# Altium schematic sheet Supplies02.SchDoc
size 431 x 279 mm; SheetNumber: 2; SheetTotal: 2; ENG_APP_DATE: --/--/--; DSN_APP_DATE: --/--/--; CHK_APP_DATE: --/--/--
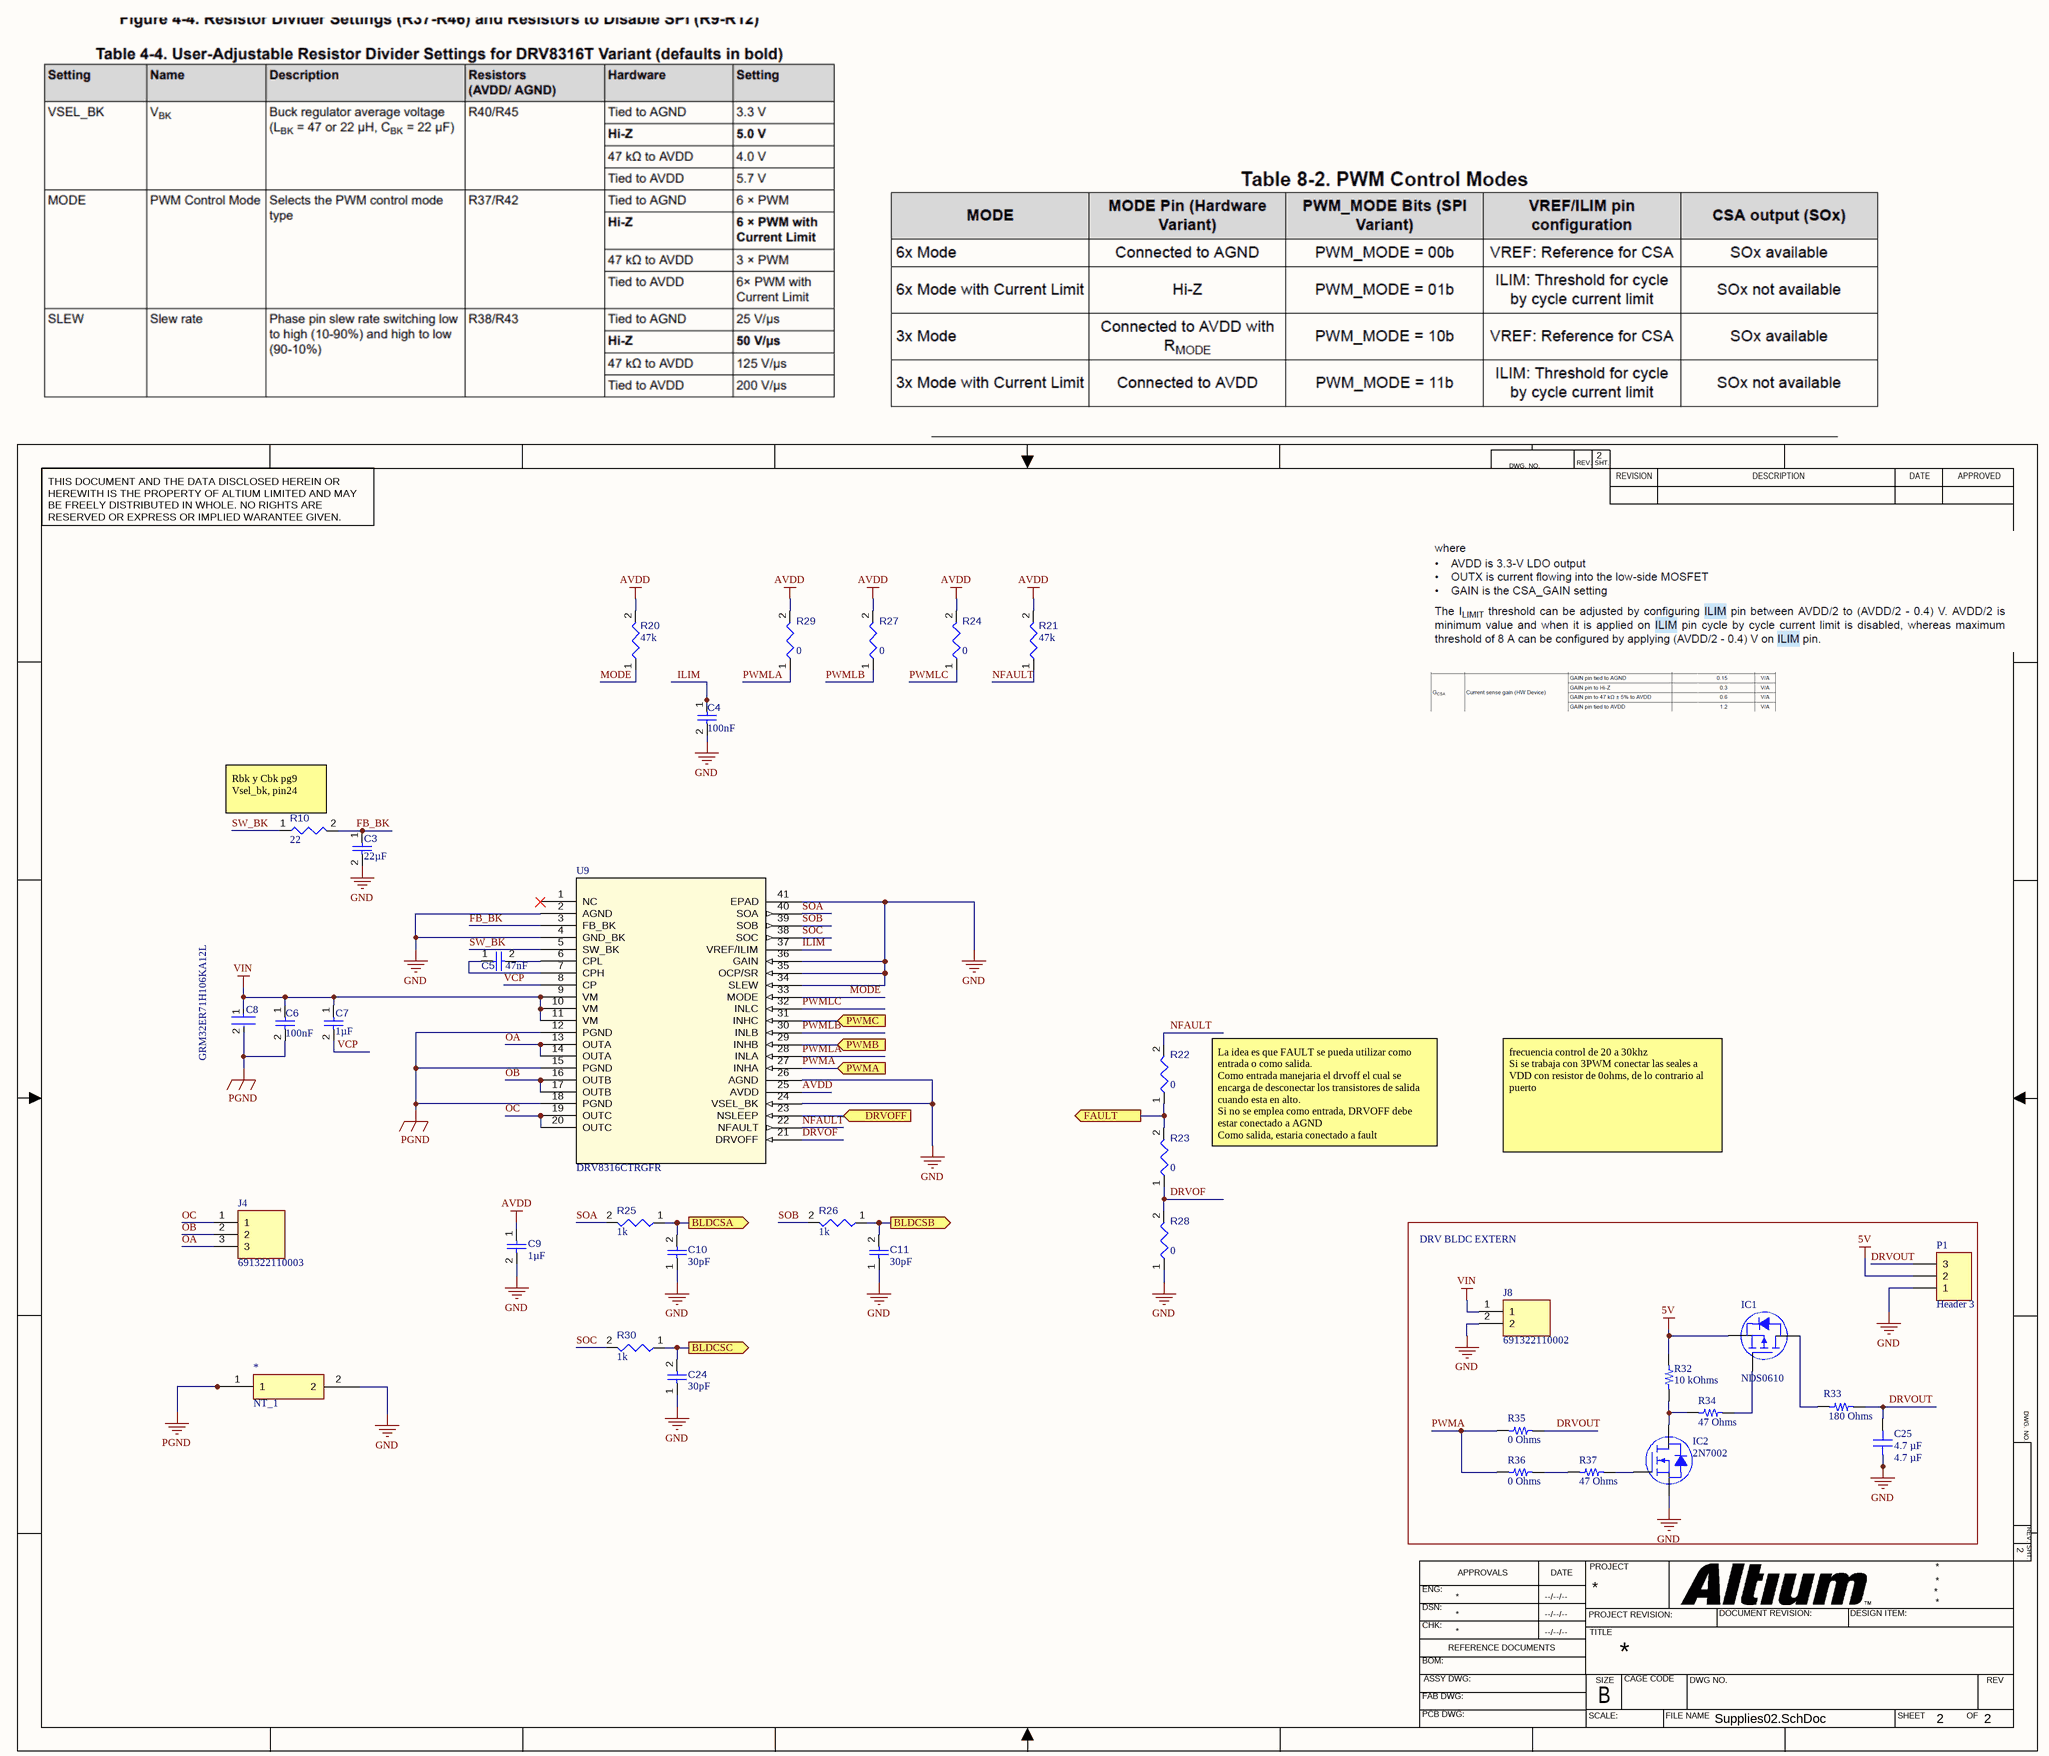
[diagram p0: Supplies02.SchDoc]

## Parts
*  NT_1  [Net_Tie]  (net tie, no BOM)
C3  value 22µF  [CAPC0805(2012)145_L]  (hidden comment: Capacitor 22µF +/-40% 16V 0805)
C4  value 100nF  [CAPC1608X90X40NL10T20]  (hidden comment: Capacitor 100 nF +/-10% 50 V 0603)
C5  value 47nF  [CAPC1608X90X40NL10T20]  (hidden comment: Capacitor 100 nF +/-10% 50 V 0603)
C6  value 100nF  [CAPC1608X90X40NL10T20]  (hidden comment: Capacitor 100 nF +/-10% 50 V 0603)
C7  value 1µF  [CAPC0805(2012)145_L]  (hidden comment: Capacitor 22µF +/-40% 16V 0805)
C8  GRM32ER71H106KA12L  [FP-GRM32-MFG]
C9  value 1µF  [CAPC0805(2012)145_L]  (hidden comment: Capacitor 22µF +/-40% 16V 0805)
C10  value 30pF  [CAPC1608X90X40NL10T20]  (hidden comment: Capacitor 100 nF +/-10% 50 V 0603)
C11  value 30pF  [CAPC1608X90X40NL10T20]  (hidden comment: Capacitor 100 nF +/-10% 50 V 0603)
C24  value 30pF  [CAPC1608X90X40NL10T20]  (hidden comment: Capacitor 100 nF +/-10% 50 V 0603)
C25  4.7 µF  [CAP 0805_2012]
IC1  NDS0610  [ON SEMI SOT-23-3]
IC2  2N7002  [ON SEMI SOT-23-3]
J4  691322110003  [SHDRRA3W80P0X350_1X3_1190X920X700P]
J8  691322110002  [SHDRRA2W80P0X350_1X2_840X920X720P]
P1  Header 3  [HDR1X3]
R10  value 22  [RESC1608X55X25ML10T15]  (hidden comment: Resistor 10k +/-1% 0603 100 mW)
R20  value 47k  [RESC1608X55X25ML10T15]  (hidden comment: Resistor 10k +/-1% 0603 100 mW)
R21  value 47k  [RESC1608X55X25ML10T15]  (hidden comment: Resistor 10k +/-1% 0603 100 mW)
R22  value 0  [RESC1608X55X25ML10T15]  (hidden comment: Resistor 10k +/-1% 0603 100 mW)
R23  value 0  [RESC1608X55X25ML10T15]  (hidden comment: Resistor 10k +/-1% 0603 100 mW)
R24  value 0  [RESC1608X55X25ML10T15]  (hidden comment: Resistor 10k +/-1% 0603 100 mW)
R25  value 1k  [RESC1608X55X25ML10T15]  (hidden comment: Resistor 10k +/-1% 0603 100 mW)
R26  value 1k  [RESC1608X55X25ML10T15]  (hidden comment: Resistor 10k +/-1% 0603 100 mW)
R27  value 0  [RESC1608X55X25ML10T15]  (hidden comment: Resistor 10k +/-1% 0603 100 mW)
R28  value 0  [RESC1608X55X25ML10T15]  (hidden comment: Resistor 10k +/-1% 0603 100 mW)
R29  value 0  [RESC1608X55X25ML10T15]  (hidden comment: Resistor 10k +/-1% 0603 100 mW)
R30  value 1k  [RESC1608X55X25ML10T15]  (hidden comment: Resistor 10k +/-1% 0603 100 mW)
R32  10 kOhms  [YAGEO RES 0603_1608]
R33  180 Ohms  [YAGEO RES 0603_1608]
R34  47 Ohms  [YAGEO RES 0603_1608]
R35  0 Ohms  [YAGEO RES 0603_1608]
R36  0 Ohms  [YAGEO RES 0603_1608]
R37  47 Ohms  [YAGEO RES 0603_1608]
U9  DRV8316CTRGFR  [VQFN40_RGF_TEX]

## Blocks framed on the sheet
DRV BLDC EXTERN: C25 IC1 IC2 J8 P1 R32-R37

## Ports
BLDCSA (out), BLDCSB (out), BLDCSC (out), DRVOFF (in), FAULT (out), PWMA (in), PWMB (in), PWMC (in)

## Nets
5V: IC1.2(S) P1.2 R32.2
AVDD: C9.1 R20.2 R21.2 R24.2 R27.2 R29.2 U9.25(AVDD)
GND: *.2 C3.2 C4.2 C9.2 C10.1 C11.1 C24.1 C25.1 IC2.2(S) J8.2 P1.1 R28.1 U9.2(AGND) U9.4(GND_BK) U9.24(VSEL_BK) U9.26(AGND) U9.34(SLEW) U9.35(OCP/SR) U9.36(GAIN) U9.41(EPAD)
PGND: *.1 C6.2 C8.2 U9.12(PGND) U9.15(PGND) U9.18(PGND)
VIN: C6.1 C7.1 C8.1 J8.1 U9.9(VM) U9.10(VM) U9.11(VM)
BLDCSA: C10.2 R25.1 ; port BLDCSA
BLDCSB: C11.2 R26.1 ; port BLDCSB
BLDCSC: C24.2 R30.1 ; port BLDCSC
DRVOF: R23.1 R28.2 U9.21(DRVOFF)
DRVOFF: U9.23(NSLEEP) ; port DRVOFF
DRVOUT: C25.2 P1.3 R33.2 R35.2
FAULT: R22.1 R23.2 ; port FAULT
FB_BK: C3.1 R10.2 U9.3(FB_BK)
ILIM: C4.1 U9.37(VREF/ILIM)
MODE: R20.1 U9.33(MODE)
NFAULT: R21.1 R22.2 U9.22(NFAULT)
OA: J4.3 U9.13(OUTA) U9.14(OUTA)
OB: J4.2 U9.16(OUTB) U9.17(OUTB)
OC: J4.1 U9.19(OUTC) U9.20(OUTC)
PWMA: R35.1 R36.1 U9.27(INHA) ; port PWMA
PWMB: U9.29(INHB) ; port PWMB
PWMC: U9.31(INHC) ; port PWMC
PWMLA: R29.1 U9.28(INLA)
PWMLB: R27.1 U9.30(INLB)
PWMLC: R24.1 U9.32(INLC)
SOA: R25.2 U9.40(SOA)
SOB: R26.2 U9.39(SOB)
SOC: R30.2 U9.38(SOC)
SW_BK: R10.1 U9.5(SW_BK)
VCP: C7.2 U9.8(CP)
NetC5_1: C5.1 U9.7(CPH)
NetC5_2: C5.2 U9.6(CPL)
NetIC1_1: IC1.1(G) R34.2
NetIC1_3: IC1.3(D) R33.1
NetIC2_1: IC2.1(G) R37.2
NetIC2_3: IC2.3(D) R32.1 R34.1
NetR36_2: R36.2 R37.1

Not connected (* = marked no-connect by the designer): U9 1(NC)*

## Notes on the sheet
- (near R10) Rbk y Cbk pg9
  Vsel_bk, pin24
- La idea es que FAULT se pueda utilizar como entrada o como salida.
  Como entrada manejaria el drvoff el cual se encarga de desconectar los transistores de salida cuando esta en alto.
  Si no se emplea como entrada, DRVOFF debe estar conectado a AGND
  Como salida, estaria conectado a fault
- frecuencia control de 20 a 30khz
  Si se trabaja con 3PWM conectar las seales a VDD con resistor de 0ohms, de lo contrario al puerto
- DWG. NO.
- REV.
- SHT.
- THIS DOCUMENT AND THE DATA DISCLOSED HEREIN OR HEREWITH IS THE PROPERTY OF ALTIUM LIMITED AND MAY BE FREELY DISTRIBUTED IN WHOLE. NO RIGHTS ARE RESERVED OR EXPRESS OR IMPLIED WARANTEE GIVEN.
- REVISION
- DESCRIPTION
- DATE
- APPROVED
- ENG:
- APPROVALS
- PROJECT
- DSN:
- CHK:
- REFERENCE DOCUMENTS
- PROJECT REVISION:
- TITLE
- DOCUMENT REVISION:
- DESIGN ITEM:
- BOM:
- FAB DWG:
- PCB DWG:
- ASSY DWG:
- SCALE:
- SIZE
- B
- CAGE CODE
- FILE NAME
- DWG NO.
- SHEET
- OF
- REV

## Library data of the parts
C3 C7 C9 = CMP-001-00081-4: Chip Capacitor, 22µF +/-40%, 16V, 0805, Thickness 1.45 mm; Tolerance: 5%; Voltage Rating: 16V; Mounting Technology: SMT; Pins: 2; Max Operating Temperature: 85°C; Case/Package: 0805; Min Operating Temperature: -55°C
C4-C6 C10 C11 C24 = CMP-001-00017-6: Chip Capacitor, 100 nF, +/- 10%, 50 V, 0603 (1608 Metric); Capacitor Type: Ceramic; Voltage Rating: 50V; Max Operating Temperature: 125°C; Min Operating Temperature: -55°C; Case/Package: 0603; Mounting Technology: SM; Pins: 2; Tolerance: 10%; RoHS Compliant: True
C8 = CMP-2000-05261-2: CAP CER 10UF 50V X7R 1210; Manufacturer: Murata; Tolerance: 10%; Material: Ceramic; Temperature Coefficient: 15%; Voltage Rating: 50V; Temperature Characteristic: X7R; Value: 10uF; ComponentLink2Description: Datasheet; Device Class L1: Passive Components; Lead Free: Yes; Temperature Range High: +125°C; Category: Cap; Manufacturer Part Number: GRM32ER71H106KA12L; ComponentLink2URL: https://search.murata.co.jp/Ceramy/image/img/A01X/G101/ENG/GRM32ER71H106KA12-01.pdf; Device Class L2: Capacitors; Package: GRM32; Mouser Description: 1210 10 uF 50 V ±10% Tolerance X7R SMT Multilayer Ceramic Capacitor; Capacitance: 10uF; Octopart: https://octopart.com/grm32er71h106ka12l-murata-10470987; Digikey Description: CAP CER 10UF 50V X7R 1210; Height: 2.7mm; Temperature: -55°C to +125°C; Temperature Range Low: -55°C; RoHS: TRUE; Device Class L3: Ceramic Capacitors; Automotive: No
C25 = C0805X475J9RACAUTO: CAP CER 4.7UF 6.3V X7R 0805; manufacturer: KEMET; Tolerance: ±5%; Part Number: C0805X475J9RACAUTO; Capacitance: 4.7 µF; Applications: Automotive, Boardflex Sensitive; componentlink1description: Datasheet; componentlink1url: https://api.kemet.com/component-edge/download/datasheet/C0805X475J9RACAUTO.pdf; componentlink2description: DigiKey Link; componentlink2url: https://www.digikey.com/en/products/detail/kemet/C0805X475J9RACAUTO/7427557; Device Package: 0805 (2012 Metric); Features: Soft Termination; lastupdated: 2024-02-09 20:16:08; Lifecycle Status: Active; Minimum Order: 1; Mounting Type: Surface Mount, MLCC; Operating Temperature: -55°C ~ 125°C; Package / Case: 0805 (2012 Metric); packaging: TapeAndReel; partid: 2889; Part Status: Active; price: 0.20; Ratings: AEC-Q200; series: SMD Auto X7R Flex; Size / Dimension: 0.079" L x 0.049" W (2.00mm x 1.25mm); Supplier 1: DigiKey; Supplier Part Number 1: 399-15727-1-ND; Temperature Coefficient: X7R; Thickness (Max): 0.057" (1.45mm); value: 4.7 µF; Voltage - Rated: 6.3V
IC1 = NDS0610: MOSFET P-CH 60V 120MA SOT-23; Manufacturer: ON Semiconductor; Current - Continuous Drain (Id) @ 25°C: 120mA (Ta); Drive Voltage (Max Rds On,  Min Rds On): 4.5V, 10V; FET Type: P-Channel; Gate Charge (Qg) (Max) @ Vgs: 2.5nC @ 10V; Input Capacitance (Ciss) (Max) @ Vds: 79pF @ 25V; Power Dissipation (Max): 360mW (Ta); Rds On (Max) @ Id, Vgs: 10Ohm @ 500mA, 10V; Vgs (Max): ±20V; Vgs(th) (Max) @ Id: 3.5V @ 1mA; Part Number: NDS0610; ComponentLink1Description: Datasheet; ComponentLink1URL: https://www.onsemi.com/pub/Collateral/NDS0610-D.PDF; ComponentLink2Description: DigiKey Link; ComponentLink2URL: http://digikey.com/product-detail/en/on-semiconductor/NDS0610/NDS0610CT-ND/244299; Drain to Source Voltage (Vdss): 60V; LastUpdated: 2024-06-03 20:15:27; Lifecycle Status: Active; Minimum Order: 1; Mounting Type: Surface Mount; Operating Temperature: -55°C ~ 150°C (TJ); Package / Case: TO-236-3, SC-59, SOT-23-3; Packaging: TapeAndReel; Part Status: Active; Price: 0.06; Series: -; Supplier 1: DigiKey; Supplier Part Number 1: NDS0610CT-ND; Supplier Device Package: SOT-23; Technology: MOSFET (Metal Oxide)
IC2 = 2N7002: MOSFET N-CH 60V 115MA SOT-23; Manufacturer: ON Semiconductor; Current - Continuous Drain (Id) @ 25°C: 115mA (Ta); Drive Voltage (Max Rds On,  Min Rds On): 5V, 10V; FET Type: N-Channel; Input Capacitance (Ciss) (Max) @ Vds: 50pF @ 25V; Power Dissipation (Max): 200mW (Ta); Rds On (Max) @ Id, Vgs: 7.5Ohm @ 500mA, 10V; Vgs (Max): ±20V; Vgs(th) (Max) @ Id: 2.5V @ 250µA; Part Number: 2N7002; ComponentLink1Description: Datasheet; ComponentLink1URL: https://www.onsemi.com/pub/Collateral/NDS7002A-D.PDF; ComponentLink2Description: DigiKey Link; ComponentLink2URL: http://digikey.com/product-detail/en/on-semiconductor/2N7002/2N7002NCT-ND/244664; Drain to Source Voltage (Vdss): 60V; LastUpdated: 2024-06-03 20:15:26; Lifecycle Status: Active; Minimum Order: 1; Mounting Type: Surface Mount; Operating Temperature: -55°C ~ 150°C (TJ); Package / Case: TO-236-3, SC-59, SOT-23-3; Packaging: TapeAndReel; Part Status: Active; Price: 0.06; Series: -; Supplier 1: DigiKey; Supplier Part Number 1: 2N7002NCT-ND; Supplier Device Package: SOT-23 (TO-236AB); Technology: MOSFET (Metal Oxide)
J4 = 691322110003: Pluggable Terminal Block Wurth Elektronik 3221 Series 3.5mm Pitch, 3 Way Straight, PCB Header, Through Hole; Geometry.Height: 7mm; Manufacturer_Name: Wurth Elektronik; Manufacturer_Part_Number: 691322110003; Mouser Part Number: 710-691322110003; Mouser Price/Stock: https://www.mouser.co.uk/ProductDetail/Wurth-Elektronik/691322110003?qs=E2PpAYvlWVuH5qLC1GE%2FCQ%3D%3D; Arrow Part Number: *; Arrow Price/Stock: *; Datasheet Link: http://katalog.we-online.de/em/datasheet/6913221100xx.pdf
J8 = 691322110002: WR-TBL Terminal block - serie 3221; Manufacturer_Name: Wurth Elektronik; Geometry.Height: 7.2mm; Manufacturer_Part_Number: 691322110002; Mouser Part Number: 710-691322110002; Mouser Price/Stock: https://www.mouser.co.uk/ProductDetail/Wurth-Elektronik/691322110002?qs=7gQLVZk5cPkDEmUnh1n5zw%3D%3D; Arrow Part Number: *; Arrow Price/Stock: *; Datasheet Link: http://katalog.we-online.de/em/datasheet/6913221100xx.pdf
P1 = Header 3: Header, 3-Pin; LatestRevisionDate: 17-Jul-2002; LatestRevisionNote: Re-released for DXP Platform.; Publisher: Altium Limited
R10 R20-R28 R30 = CMP-009-00017-5: Chip Resistor, 10 KOhm, +/- 1%, 01 W, -55 to 155 degC, 0603 (1608 Metric); Voltage Rating: 50V; Power: 100mW; RoHS Compliant: True; Min Operating Temperature: -55°C; Pins: 2; Case/Package: 0603; Mounting Technology: SM; Max Operating Temperature: 155°C; Tolerance: 1%
R29 = RES-2: Chip Resistor, 10 KOhm, +/- 1%, 01 W, -55 to 155 degC, 0603 (1608 Metric); Voltage Rating: 50V; Power: 100mW; RoHS Compliant: True; Min Operating Temperature: -55°C; Pins: 2; Case/Package: 0603; Mounting Technology: SM; Max Operating Temperature: 155°C; Tolerance: 1%
R32 = RT0603DRD0710KL: RES SMD 10K OHM 0.5% 1/10W 0603; Manufacturer: Yageo; Power (Watts): 0.1W, 1/10W; Temperature Coefficient: ±25ppm/°C; Part Number: RT0603DRD0710KL; Value: 10 kOhms; ComponentLink1Description: Datasheet; ComponentLink1URL: https://www.yageo.com/upload/media/product/productsearch/datasheet/rchip/PYu-RT_1-to-0.01_RoHS_L_11.pdf; ComponentLink2Description: DigiKey Link; ComponentLink2URL: https://www.digikey.com/en/products/detail/yageo/RT0603DRD0710KL/1035416; Composition: Thin Film; Device Package: 0603 (1608 Metric); Height - Seated (Max): 0.022" (0.55mm); LastUpdated: 2024-07-25 09:19:32; Lifecycle Status: Active; Minimum Order: 1; Number of Terminations: 2; Operating Temperature: -55°C ~ 155°C; Package / Case: 0603 (1608 Metric); Packaging: TapeAndReel; PartId: 5487; Part Status: Active; Price: 0.02; Resistance: 10 kOhms; Series: RT; Size / Dimension: 0.063" L x 0.031" W (1.60mm x 0.80mm); Supplier 1: DigiKey; Supplier Part Number 1: 311-10KDCT-ND; Supplier Device Package: 0603; Tolerance: ±0.5%
R33 = RT0603BRD07180RL: RES SMD 180 OHM 0.1% 1/10W 0603; Manufacturer: Yageo; Power (Watts): 0.1W, 1/10W; Temperature Coefficient: ±25ppm/°C; Part Number: RT0603BRD07180RL; Value: 180 Ohms; ComponentLink1Description: Datasheet; ComponentLink1URL: https://www.yageo.com/upload/media/product/productsearch/datasheet/rchip/PYu-RT_1-to-0.01_RoHS_L_11.pdf; ComponentLink2Description: DigiKey Link; ComponentLink2URL: https://www.digikey.com/en/products/detail/yageo/RT0603BRD07180RL/1072294; Composition: Thin Film; Device Package: 0603 (1608 Metric); Height - Seated (Max): 0.022" (0.55mm); LastUpdated: 2024-07-25 09:19:32; Lifecycle Status: Active; Minimum Order: 1; Number of Terminations: 2; Operating Temperature: -55°C ~ 155°C; Package / Case: 0603 (1608 Metric); Packaging: TapeAndReel; PartId: 6294; Part Status: Active; Price: 0.03; Resistance: 180 Ohms; Series: RT; Size / Dimension: 0.063" L x 0.031" W (1.60mm x 0.80mm); Supplier 1: DigiKey; Supplier Part Number 1: YAG1549CT-ND; Supplier Device Package: 0603; Tolerance: ±0.1%
R34 R37 = SR0603JR-7T47RL: RES 47 OHM 5% 1/4W 0603; Manufacturer: Yageo; Power (Watts): 0.25W, 1/4W; Temperature Coefficient: ±100ppm/°C; Part Number: SR0603JR-7T47RL; Value: 47 Ohms; ComponentLink1Description: Datasheet; ComponentLink1URL: http://www.yageo.com/NewPortal/_en/search/productDocs.jsp?YageoPartNumber=SR0603JR-7T47RL; ComponentLink2Description: DigiKey Link; ComponentLink2URL: https://www.digikey.com/en/products/detail/yageo/SR0603JR-7T47RL/9696400; Composition: Thick Film; Device Package: 0603 (1608 Metric); Features: Automotive AEC-Q200, Pulse Withstanding; Height - Seated (Max): 0.022" (0.55mm); LastUpdated: 2024-07-25 09:19:30; Lifecycle Status: Active; Minimum Order: 1; Number of Terminations: 2; Operating Temperature: -55°C ~ 155°C; Package / Case: 0603 (1608 Metric); Packaging: TapeAndReel; PartId: 8875; Part Status: Active; Price: 0.03; Ratings: AEC-Q200; Resistance: 47 Ohms; Series: SR; Size / Dimension: 0.063" L x 0.031" W (1.60mm x 0.80mm); Supplier 1: DigiKey; Supplier Part Number 1: YAG6162CT-ND; Supplier Device Package: 0603; Tolerance: ±5%
R35 R36 = PA0603-R-070RL: RES 0 OHM JUMPER 1/2W 0603; Manufacturer: Yageo; Power (Watts): 0.1W, 1/10W; Temperature Coefficient: ±150ppm/°C; Part Number: PA0603-R-070RL; Value: 0 Ohms; ComponentLink1Description: Datasheet; ComponentLink1URL: http://www.yageo.com/NewPortal/_en/search/productDocs.jsp?YageoPartNumber=PA0603-R-070RL; ComponentLink2Description: DigiKey Link; ComponentLink2URL: https://www.digikey.com/en/products/detail/yageo/PA0603-R-070RL/8255972; Composition: Metal Element; Device Package: 0603 (1608 Metric); Features: Automotive AEC-Q200, Current Sense; Height - Seated (Max): 0.024" (0.60mm); LastUpdated: 2024-07-25 09:19:32; Lifecycle Status: Active; Minimum Order: 1; Number of Terminations: 2; Operating Temperature: -55°C ~ 155°C; Package / Case: 0603 (1608 Metric); Packaging: TapeAndReel; PartId: 4862; Part Status: Active; Price: 0.08; Resistance: 0 Ohms; Series: PA; Size / Dimension: 0.063" L x 0.031" W (1.60mm x 0.80mm); Supplier 1: DigiKey; Supplier Part Number 1: YAG5757CT-ND; Supplier Device Package: 0603; Tolerance: Jumper
U9 = DRV8316CTRGFR: No Description Available; Mfr_Name: Texas Instruments; Type: DEV; Copyright: Copyright (C) 2024 Ultra Librarian. All rights reserved.; Manufacturer_Part_Number: DRV8316CTRGFR; RefDes: RefDes